# Altium schematic sheet nRF24L01.SchDoc
size A
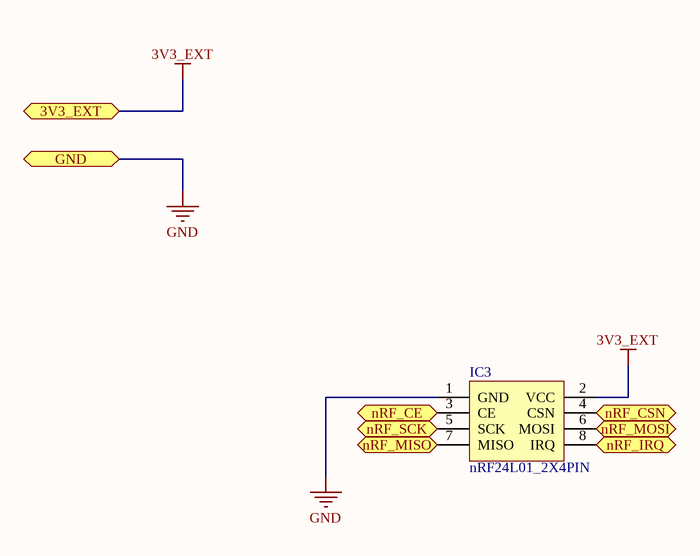
[diagram p0: nRF24L01.SchDoc]

## Parts
IC3  nRF24L01_2X4PIN  [nRF24L01_module]

## Ports
3V3_EXT, GND, nRF_CE (in), nRF_CSN (in), nRF_IRQ (out), nRF_MISO (out), nRF_MOSI (in), nRF_SCK (in)

## Nets
3V3_EXT: IC3.2(VCC) ; port 3V3_EXT
GND: IC3.1(GND) ; port GND
nRF_CE: IC3.3(CE) ; port nRF_CE
nRF_CSN: IC3.4(CSN) ; port nRF_CSN
nRF_IRQ: IC3.8(IRQ) ; port nRF_IRQ
nRF_MISO: IC3.7(MISO) ; port nRF_MISO
nRF_MOSI: IC3.6(MOSI) ; port nRF_MOSI
nRF_SCK: IC3.5(SCK) ; port nRF_SCK

## Library data of the parts
IC3 = nRF24L01_MOD_2X4